# EAGLE design OSWDKPCB (EAGLE 6.3)
HARDWARE_VARIANT: OSWarrior Dark Knight (DK); PROJECT_NAME: OSWarrior

## Sheet 1 of 3
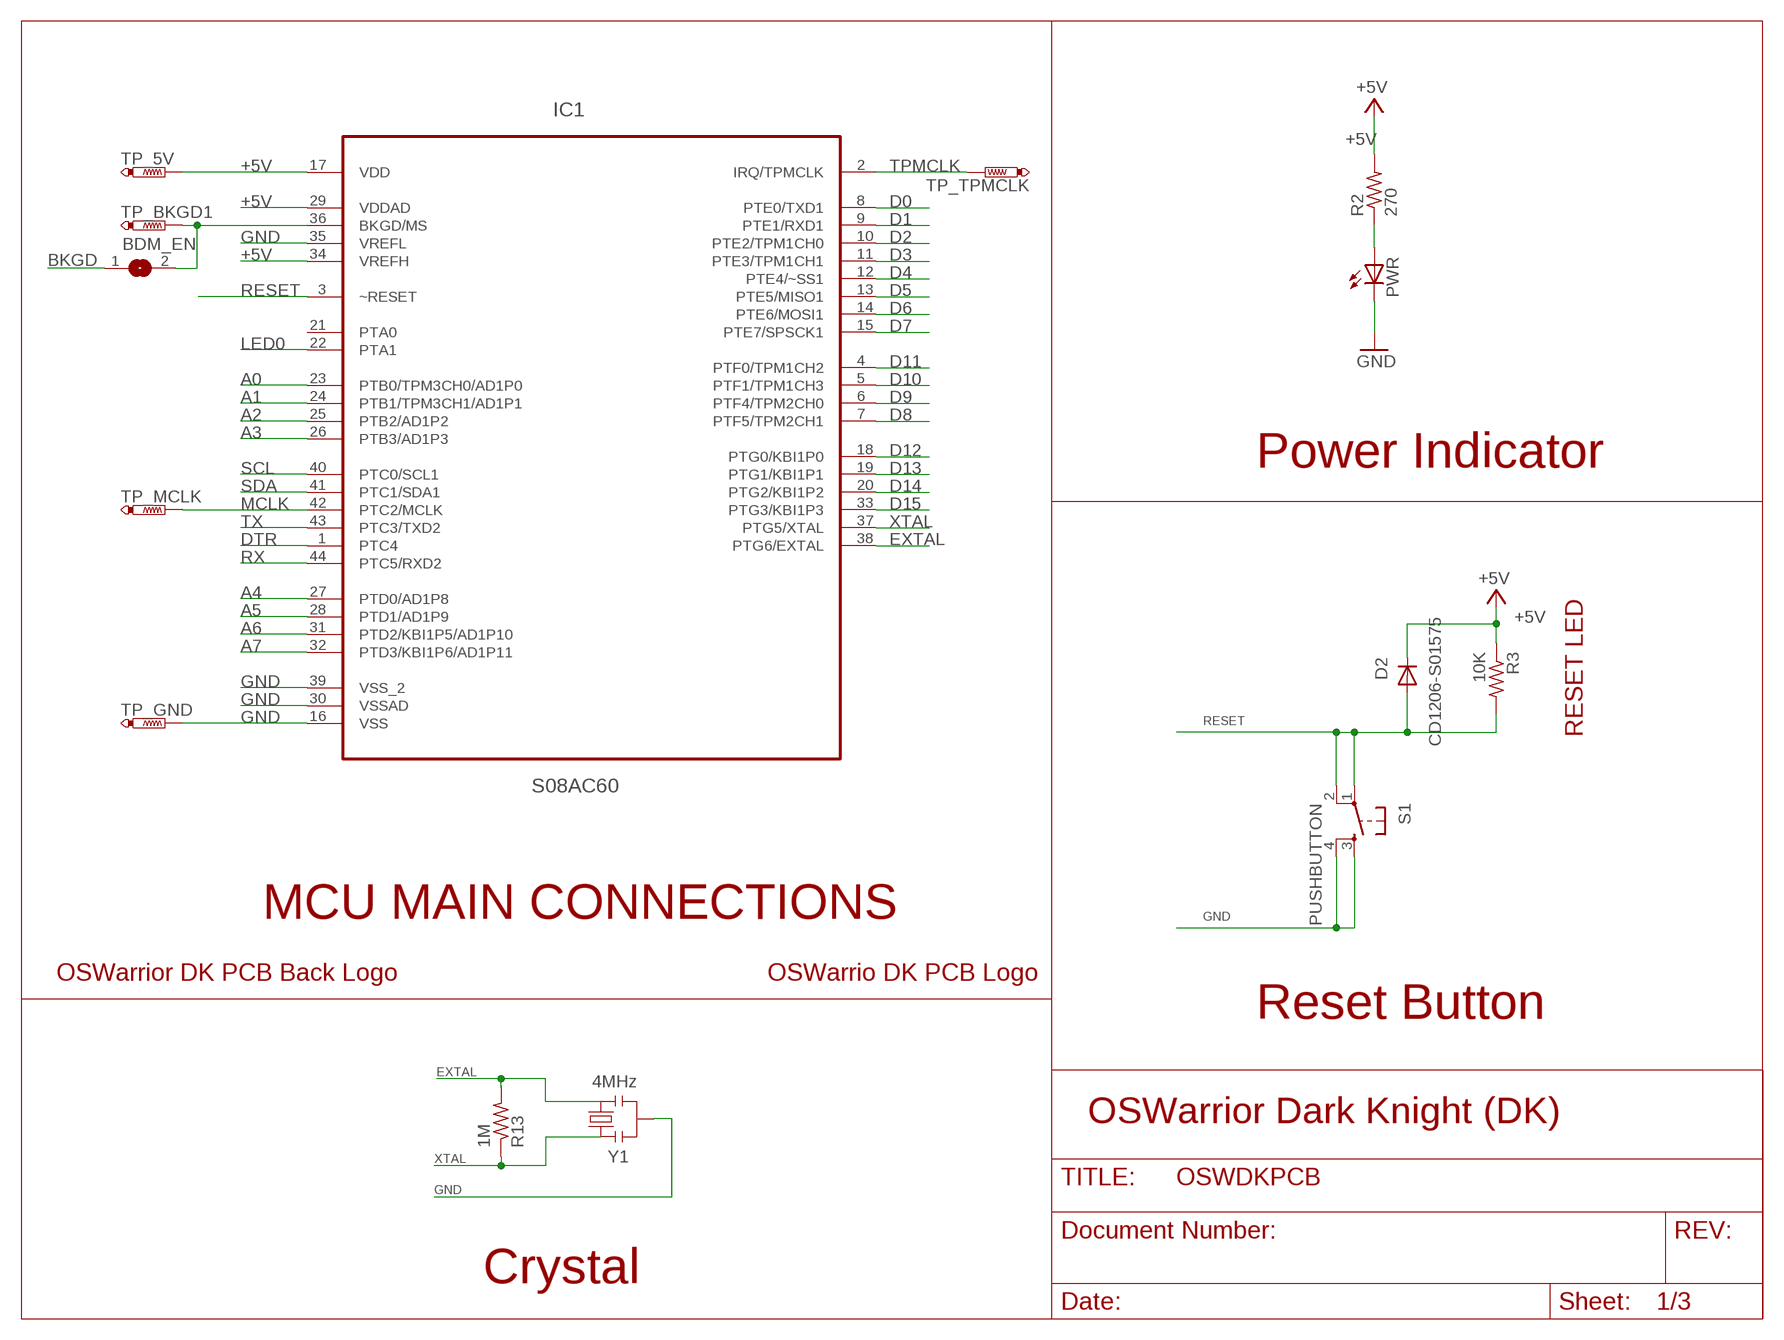
[diagram p0: schematic, sheet 1]

### Parts
BDM_EN  SJ  [SJ]
D2  CD1206-S01575  DIODE-SOD123  [SOD123]
IC1  S08AC60  MC9S08AC48CFGE_LQFP-44  [LQFP-44]
PWR  LEDCHIPLED_0805  [CHIPLED_0805]
R2  270  R-US_M0805  [M0805]
R3  10K  R-US_M0805  [M0805]
R13  1M  R-US_M0805  [M0805]
S1  PUSHBUTTON  TAC_SWITCHPTH  [TACTILE-PTH]
TP_5V  PTR1B1,27  [B1,27]
TP_BKGD1  PTR1B1,27  [B1,27]
TP_GND  PTR1B1,27  [B1,27]
TP_MCLK  PTR1B1,27  [B1,27]
TP_TPMCLK  PTR1B1,27  [B1,27]
U$1  OSWDK_LOGO  [OSWDK_LOGO]
U$2  OSWDK_BACK_LOGO  [OSWDK_BACK_LOGO]
Y1  4MHz  RESONATORSMD  [RESONATOR-SMD]

### Nets
+5V [power]: D2.C IC1.17(VDD) IC1.29(VDDAD) IC1.34(VREFH) R2.2 R3.1 TP_5V.TP ; also sheet 2,3
A0: IC1.23(PTB0/TPM3CH0/AD1P0) ; also sheet 2
A1: IC1.24(PTB1/TPM3CH1/AD1P1) ; also sheet 2
A2: IC1.25(PTB2/AD1P2) ; also sheet 2
A3: IC1.26(PTB3/AD1P3) ; also sheet 2
A4: IC1.27(PTD0/AD1P8) ; also sheet 2
A5: IC1.28(PTD1/AD1P9) ; also sheet 2
A6: IC1.31(PTD2/KBI1P5/AD1P10) ; also sheet 2
A7: IC1.32(PTD3/KBI1P6/AD1P11) ; also sheet 2
BKGD: BDM_EN.1 ; also sheet 3
D0: IC1.8(PTE0/TXD1) ; also sheet 2
D1: IC1.9(PTE1/RXD1) ; also sheet 2
D2: IC1.10(PTE2/TPM1CH0) ; also sheet 2
D3: IC1.11(PTE3/TPM1CH1) ; also sheet 2
D4: IC1.12(PTE4/~SS1) ; also sheet 2
D5: IC1.13(PTE5/MISO1) ; also sheet 2
D6: IC1.14(PTE6/MOSI1) ; also sheet 2
D7: IC1.15(PTE7/SPSCK1) ; also sheet 2
D8: IC1.7(PTF5/TPM2CH1) ; also sheet 2
D9: IC1.6(PTF4/TPM2CH0) ; also sheet 2
D10: IC1.5(PTF1/TPM1CH3) ; also sheet 2
D11: IC1.4(PTF0/TPM1CH2) ; also sheet 2
D12: IC1.18(PTG0/KBI1P0) ; also sheet 2
D13: IC1.19(PTG1/KBI1P1) ; also sheet 2
D14: IC1.20(PTG2/KBI1P2) ; also sheet 2
D15: IC1.33(PTG3/KBI1P3) ; also sheet 2
DTR: IC1.1(PTC4)
EXTAL: IC1.38(PTG6/EXTAL) R13.2 Y1.3
GND [power]: IC1.16(VSS) IC1.30(VSSAD) IC1.35(VREFL) IC1.39(VSS_2) PWR.C S1.3 S1.4 TP_GND.TP Y1.2 ; also sheet 2,3
LED0: IC1.22(PTA1) ; also sheet 2
MCLK: IC1.42(PTC2/MCLK) TP_MCLK.TP
N$6: BDM_EN.2 IC1.36(BKGD/MS) TP_BKGD1.TP
N$14: PWR.A R2.1
RESET: D2.A IC1.3(~RESET) R3.2 S1.1 S1.2 ; also sheet 2,3
RX: IC1.44(PTC5/RXD2) ; also sheet 3
SCL: IC1.40(PTC0/SCL1) ; also sheet 2
SDA: IC1.41(PTC1/SDA1) ; also sheet 2
TPMCLK: IC1.2(IRQ/TPMCLK) TP_TPMCLK.TP
TX: IC1.43(PTC3/TXD2) ; also sheet 3
XTAL: IC1.37(PTG5/XTAL) R13.1 Y1.1
Unconnected: IC1.21(PTA0)

### Notes on the sheet
- Power Indicator
- RESET LED
- MCU MAIN CONNECTIONS
- Reset Button
- Crystal

## Sheet 2 of 3
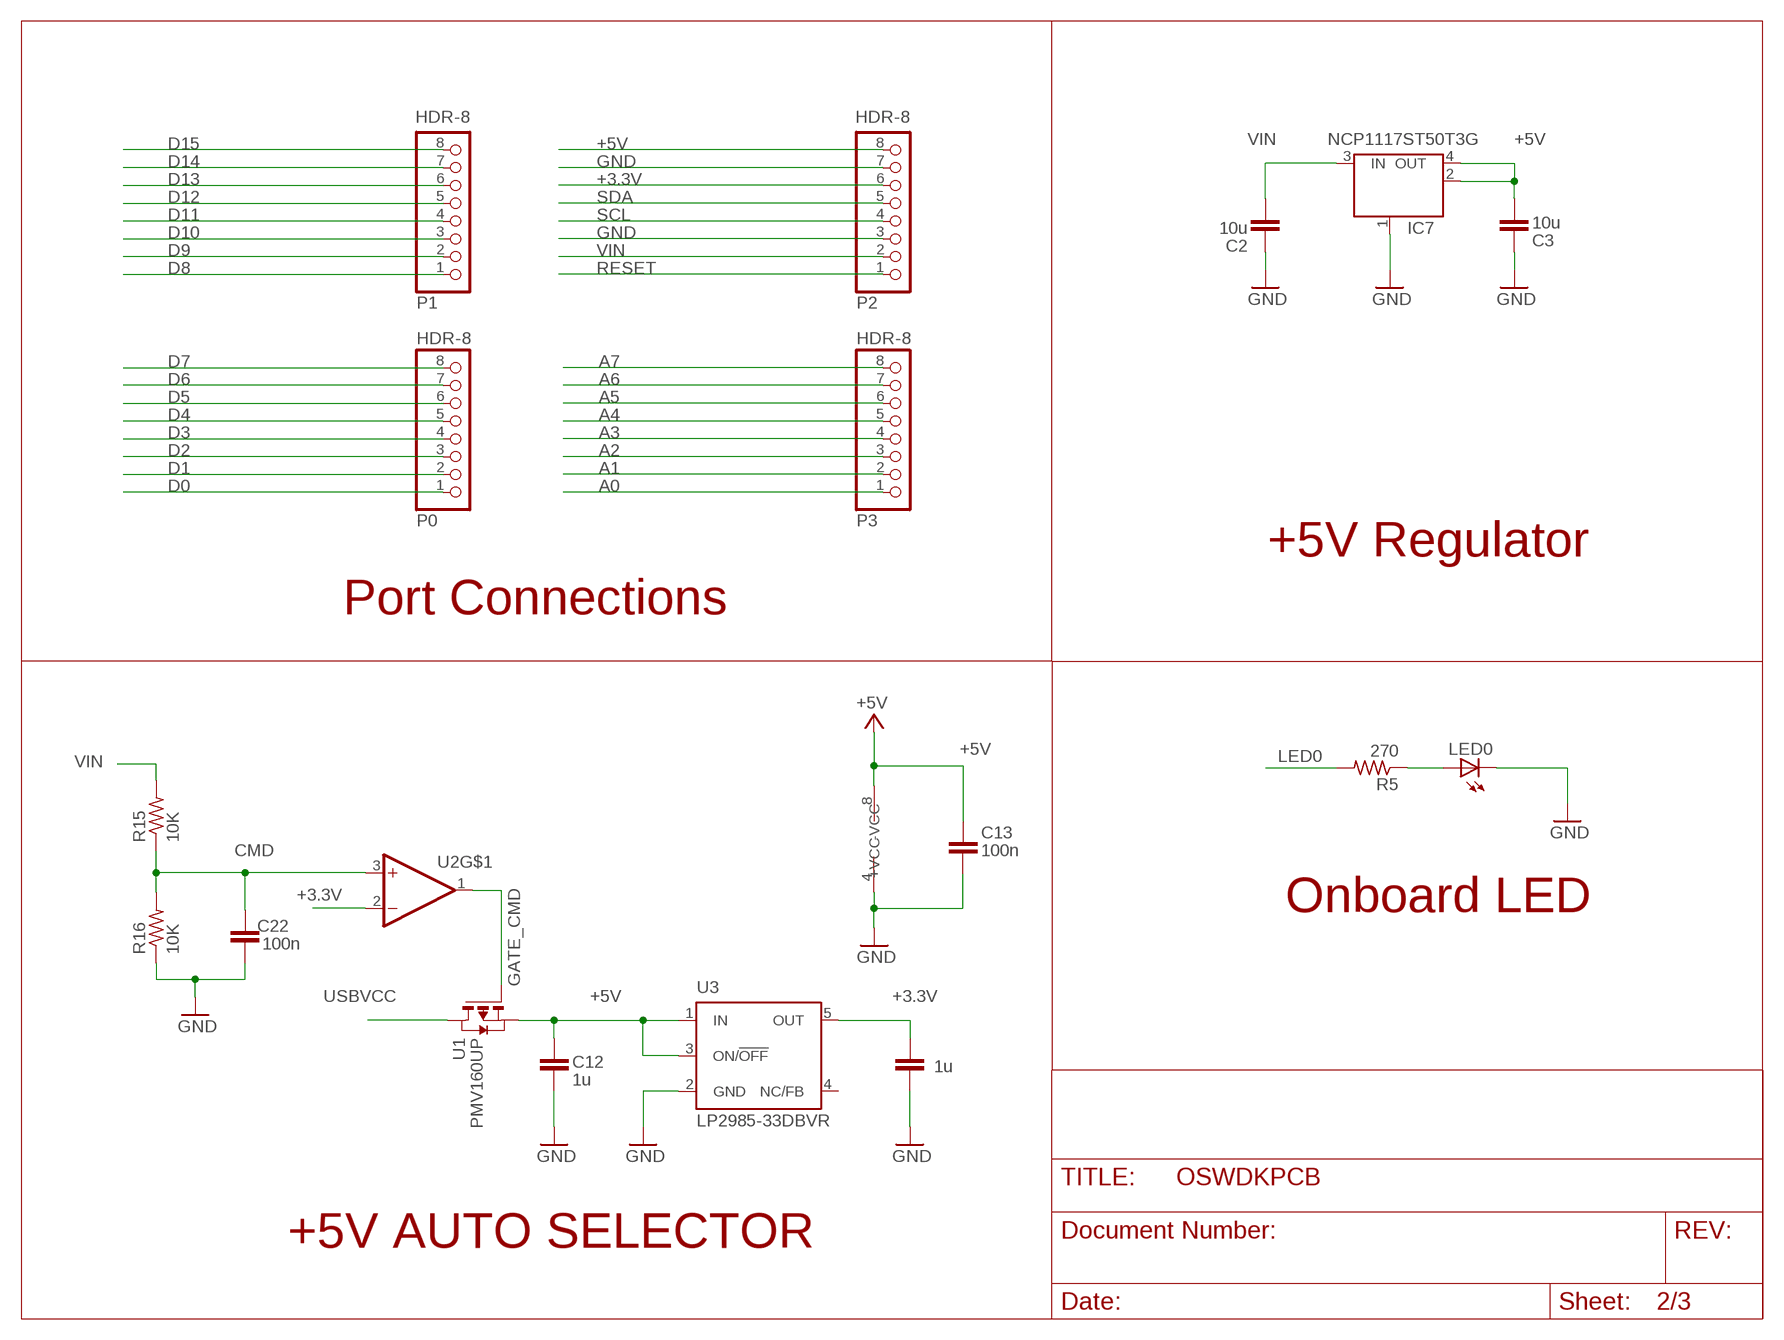
[diagram p1: schematic, sheet 2]

### Parts
C2  10u  C-EUC0805  [C0805]
C3  10u  C-EUC0805  [C0805]
C12  1u  C-EUC0805  [C0805]
C13  100n  C-EUC0805  [C0805]
C14  1u  C-EUC0805  [C0805]
C22  100n  C-EUC0805  [C0805]
IC7  NCP1117ST50T3G  MC33269ST-3.3T3  [SOT223]
LED0  LEDCHIPLED_0805  [CHIPLED_0805]
P0  HDR-8  PINHD-1X8  [1X08]
P1  HDR-8  PINHD-1X8  [1X08]
P2  HDR-8  PINHD-1X8  [1X08]
P3  HDR-8  PINHD-1X8  [1X08]
R5  270  R-US_M0805  [M0805]
R15  10K  R-US_M0805  [M0805]
R16  10K  R-US_M0805  [M0805]
U1  PMV160UP  [SOT-23]
U2  RC4558  [SOIC-8]
U3  LP2985-33DBVR  LP2985-XXDBVR33  [SOT23-DBV]

### Nets
+3.3V: C14.2 P2.6 U2.2(-IN1) U3.5(OUT)
+5V [power]: C3.1 C12.2 C13.1 IC7.2(OUT) IC7.4(OUT) P2.8 U1.2(S) U2.8(+VCC) U3.1(IN) U3.3(ON/!OFF) ; also sheet 1,3
A0: P3.1 ; also sheet 1
A1: P3.2 ; also sheet 1
A2: P3.3 ; also sheet 1
A3: P3.4 ; also sheet 1
A4: P3.5 ; also sheet 1
A5: P3.6 ; also sheet 1
A6: P3.7 ; also sheet 1
A7: P3.8 ; also sheet 1
CMD: C22.2 R15.1 R16.2 U2.3(+IN1)
D0: P0.1 ; also sheet 1
D1: P0.2 ; also sheet 1
D2: P0.3 ; also sheet 1
D3: P0.4 ; also sheet 1
D4: P0.5 ; also sheet 1
D5: P0.6 ; also sheet 1
D6: P0.7 ; also sheet 1
D7: P0.8 ; also sheet 1
D8: P1.1 ; also sheet 1
D9: P1.2 ; also sheet 1
D10: P1.3 ; also sheet 1
D11: P1.4 ; also sheet 1
D12: P1.5 ; also sheet 1
D13: P1.6 ; also sheet 1
D14: P1.7 ; also sheet 1
D15: P1.8 ; also sheet 1
GATE_CMD: U1.3(G) U2.1(OUT1)
GND [power]: C2.2 C3.2 C12.1 C13.2 C14.1 C22.1 IC7.1(GND/ADJ) LED0.C P2.3 P2.7 R16.1 U2.4(-VCC) U3.2(GND) ; also sheet 1,3
LED0: R5.2 ; also sheet 1
N$8: LED0.A R5.1
RESET: P2.1 ; also sheet 1,3
SCL: P2.4 ; also sheet 1
SDA: P2.5 ; also sheet 1
USBVCC [power]: U1.1(D) ; also sheet 3
VIN [power]: C2.1 IC7.3(IN) P2.2 R15.2
Unconnected: U2.5(+IN1) U2.6(-IN1) U2.7(OUT1) U3.4(NC/FB)

### Notes on the sheet
- +5V Regulator
- Port Connections
- Onboard LED
- +5V AUTO SELECTOR

## Sheet 3 of 3
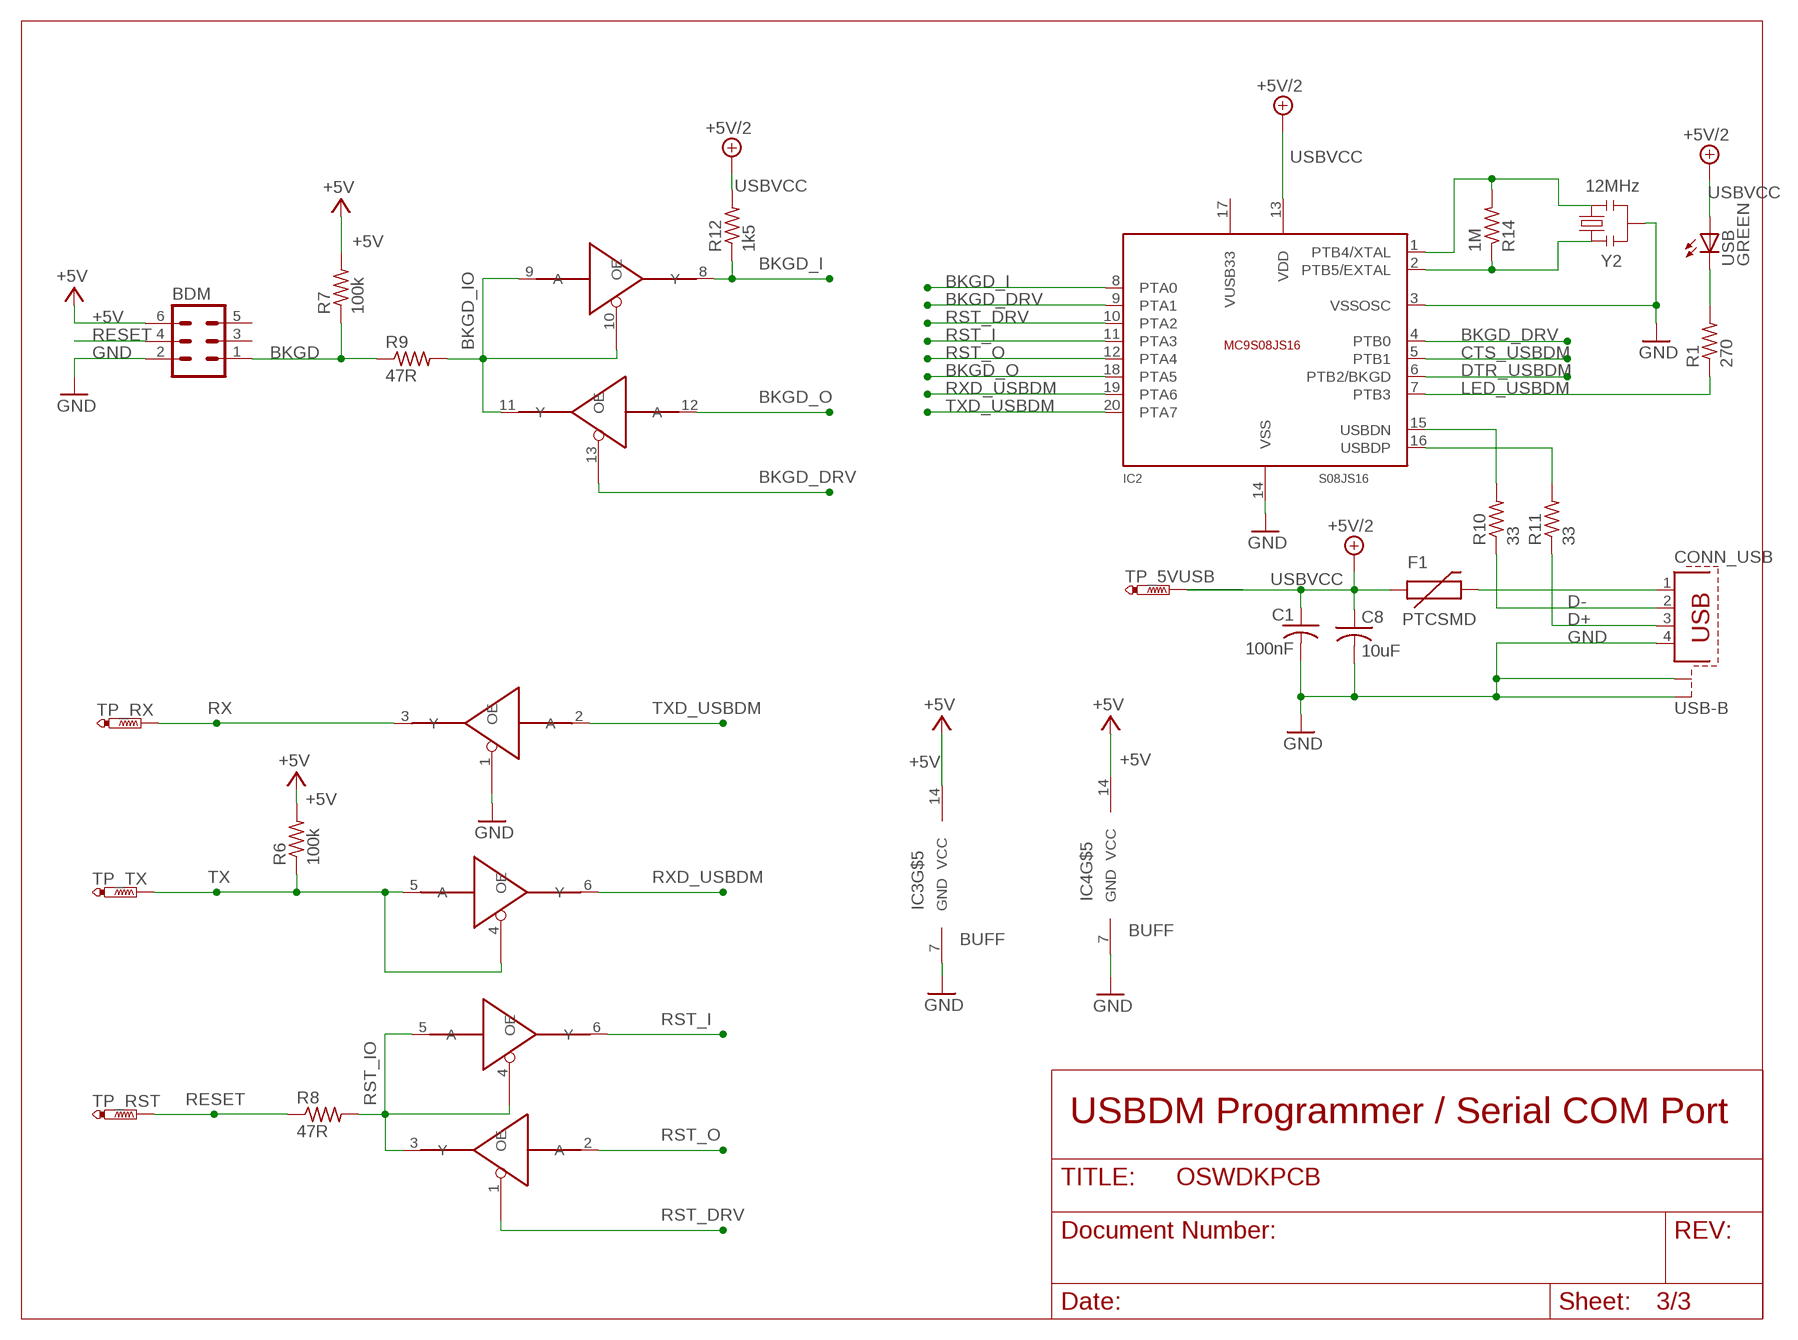
[diagram p2: schematic, sheet 3]

### Parts
BDM  MA03-2  [MA03-2]
C1  100nF  C-USC0805  [C0805]
C8  10uF  C-USC0805  [C0805]
CONN_USB  USB-B  PN61729-S  [PN61729-S]
F1  PTCSMD  [PTC-1206]
IC2  S08JS16  MC9S08JS16CWJ_SOIC-20  [SOIC-20]
IC3  BUFF  SN74LV125APW_TSSOP-14  [TSSOP-14]
IC4  BUFF  SN74LV125APW_TSSOP-14  [TSSOP-14]
R1  270  R-US_M0805  [M0805]
R6  100k  R-US_M0805  [M0805]
R7  100k  R-US_M0805  [M0805]
R8  47R  R-US_M0805  [M0805]
R9  47R  R-US_M0805  [M0805]
R10  33  R-US_M0805  [M0805]
R11  33  R-US_M0805  [M0805]
R12  1k5  R-US_M0805  [M0805]
R14  1M  R-US_M0805  [M0805]
TP_5VUSB  PTR1B1,27  [B1,27]
TP_RST  PTR1B1,27  [B1,27]
TP_RX  PTR1B1,27  [B1,27]
TP_TX  PTR1B1,27  [B1,27]
USB  GREEN  LEDCHIPLED_0805  [CHIPLED_0805]
Y2  12MHz  RESONATORSMD  [RESONATOR-SMD]

### Nets
+5V [power]: BDM.6 IC3.14(VCC) IC4.14(VCC) R6.2 R7.2 ; also sheet 1,2
BKGD: BDM.1 R7.1 R9.1 ; also sheet 1
BKGD_DRV: IC2.4(PTB0) IC2.9(PTA1) IC4.13(OE)
BKGD_I: IC2.8(PTA0) IC4.8(Y) R12.1
BKGD_IO: IC4.9(A) IC4.10(OE) IC4.11(Y) R9.2
BKGD_O: IC2.18(PTA5) IC4.12(A)
CTS_USBDM: IC2.5(PTB1)
D+: CONN_USB.3 R11.1
D-: CONN_USB.2 R10.1
DTR_USBDM: IC2.6(PTB2/BKGD)
GND [power]: BDM.2 C1.2 C8.2 CONN_USB.4 CONN_USB.S1 CONN_USB.S2 IC2.3(VSSOSC) IC2.14(VSS) IC3.1(OE) IC3.7(GND) IC4.7(GND) Y2.2 ; also sheet 1,2
LED_USBDM: IC2.7(PTB3) R1.1
N$1: R1.2 USB.C
N$2: IC2.15(USBDN) R10.2
N$3: IC2.16(USBDP) R11.2
N$4: IC2.1(PTB4/XTAL) R14.2 Y2.3
N$5: CONN_USB.1 F1.2
N$7: IC2.2(PTB5/EXTAL) R14.1 Y2.1
RESET: BDM.4 R8.1 TP_RST.TP ; also sheet 1,2
RST_DRV: IC2.10(PTA2) IC4.1(OE)
RST_I: IC2.11(PTA3) IC4.6(Y)
RST_IO: IC4.3(Y) IC4.4(OE) IC4.5(A) R8.2
RST_O: IC2.12(PTA4) IC4.2(A)
RX: IC3.3(Y) TP_RX.TP ; also sheet 1
RXD_USBDM: IC2.19(PTA6) IC3.6(Y)
TX: IC3.4(OE) IC3.5(A) R6.1 TP_TX.TP ; also sheet 1
TXD_USBDM: IC2.20(PTA7) IC3.2(A)
USBVCC [power]: C1.1 C8.1 F1.1 IC2.13(VDD) R12.2 TP_5VUSB.TP USB.A ; supply symbol labelled +5V/2 ; also sheet 2
Unconnected: BDM.3 BDM.5 IC3.8(Y) IC3.9(A) IC3.10(OE) IC3.11(Y) IC3.12(A) IC3.13(OE)

### Notes on the sheet
- USBDM Programmer / Serial COM Port

## Power pins joined to a net without a drawn wire
VUSB33: IC2.17(VUSB33)

## Library data of the parts
BDM = con-lstb:MA03-2: PIN HEADER; OC_FARNELL: unknown; OC_NEWARK: unknown
BDM_EN = jumper:SJ: SMD solder JUMPER
C1 C8 = resistor:C-US: CAPACITOR, American symbol
C2 C3 C12-C14 C22 = SmartPrj:C-EU: CAPACITOR, European symbol
CONN_USB = con-berg:PN61729-S: BERG USB connector; OC_FARNELL: unknown; OC_NEWARK: unknown
D2 = diode:DIODE-: DIODE
F1 = SparkFun:PTC: Resettable Fuse PTC Resettable Fuse. Spark Fun Electronics SKU : COM-08357
IC1 = OSWarrior:MC9S08AC48CFGE_LQFP-44
IC2 = OSWarrior:MC9S08JS16CWJ_SOIC-20
IC3 IC4 = OSWarrior:SN74LV125APW_TSSOP-14
IC7 = linear:MC33269ST*: Adjustable Output Low Dropout Voltage Regulator 800 mA Source: http://www.onsemi.com/pub/Collateral/MC33269-D.PDF
LED0 PWR USB = led:LED: LED OSRAM: - CHIPLED LG R971, LG N971, LY N971, LG Q971, LY Q971, LO R971, LY R971 LH N974, LH R974 LS Q976, LO Q976, LY Q976 LO Q996 - Hyper CHIPLED LW Q18S LB Q993, LB Q99A, LB R99A - SideLED LS A670, LO A670, LY A670, LG A670, LP A670 LB A673, LV A673, LT A673, LW A673 LH A674 LY A675 LS A676, LA A676, LO A676, LY A676, LW A676 LS A679, LY A679, LG A679 - Hyper Micro SIDELED® LS Y876, LA Y876, LO Y876, LY Y876 LT Y87S - SmartLED LW L88C, LW L88S LB L89C, LB L89S, LG L890 LS L89K, LO L89K, LY L89K LS L896, LA L896, LO L896, LY L896 - TOPLED LS T670, LO T670, LY T670, LG T670, LP T670 LSG T670, LSP T670, LSY T670, LOP T670, LYG T670 LG T671, LOG T671, LSG T671 LB T673, LV T673, LT T673, LW T673 LH T674 LS T676, LA T676, LO T676, LY T676, LB T676, LH T676, LSB T676, LW T676 LB T67C, LV T67C, LT T67C, LS T67K, LO T67K, LY T67K, LW E67C LS E67B, LA E67B, LO E67B, LY E67B, LB E67C, LV E67C, LT E67C LW T67C LS T679, LY T679, LG T679 LS T770, LO T770, LY T770, LG T770, LP T770 LB T773, LV T773, LT T773, LW T773 LH T774 LS E675, LA E675, LY E675, LS T675 LS T776, LA T776, LO T776, LY T776, LB T776 LHGB T686 LT T68C, LB T68C - Hyper Mini TOPLED® LB M676 - Mini TOPLED Santana® LG M470 LS M47K, LO M47K, LY M47K Source: http://www.osram.convergy.de LUXEON: - LUMILED® LXK2-PW12-R00, LXK2-PW12-S00, LXK2-PW14-U00, LXK2-PW14-V00 LXK2-PM12-R00, LXK2-PM12-S00, LXK2-PM14-U00 LXK2-PE12-Q00, LXK2-PE12-R00, LXK2-PE12-S00, LXK2-PE14-T00, LXK2-PE14-U00 LXK2-PB12-K00, LXK2-PB12-L00, LXK2-PB12-M00, LXK2-PB14-N00, LXK2-PB14-P00, LXK2-PB14-Q00 LXK2-PR12-L00, LXK2-PR12-M00, LXK2-PR14-Q00, LXK2-PR14-R00 LXK2-PD12-Q00, LXK2-PD12-R00, LXK2-PD12-S00 LXK2-PH12-R00, LXK2-PH12-S00 LXK2-PL12-P00, LXK2-PL12-Q00, LXK2-PL12-R00 Source: www.luxeon.com KINGBRIGHT: KA-3528ASYC Source: www.kingbright.com
P0 P1-P3 = pinhead:PINHD-1X8: PIN HEADER
R1-R3 R5-R16 = resistor:R-US_: RESISTOR, American symbol
S1 = SparkFun:TAC_SWITCH: Momentary Switch Button commonly used for reset or general input. Spark Fun Electronics SKU : COM-00097
TP_5V TP_5VUSB TP_BKGD1 TP_GND TP_MCLK TP_RST TP_RX TP_TPMCLK TP_TX = testpad:PTR1: TEST PIN
U1 = PMV160UP:PMV160UP: P-Channel MOSFET
U2 = PMV160UP:RC4558: Dual General-Purpose Operational Amplifier
U3 = SmartPrj:LP2985-XXDBVR: ULTRALOW-POWER 50-mA LOW-DROPOUT LINEAR REGULATORS 50-mA Low-Dropout Regulator Source: http://focus.ti.com/lit/ds/symlink/tps77001.pdf
U$1 = OSWarrior:OSWDK_LOGO
U$2 = OSWarrior:OSWDK_BACK_LOGO
Y1 Y2 = SparkFun:RESONATOR: Resonator Small SMD resonator. This is the itty bitty 10/20MHz resonators with built in caps. CSTCE10M0G55 and CSTCE20M0V53. Footprint has been reviewed closely but hasn't been tested yet.

## Net classes
0 default: width 0.406 mm
1 power: width 0.61 mm, drill 0.61 mm, clearance 0.254 mm
2 gnd: width 0.305 mm, drill 0.559 mm, clearance 0.254 mm
3 usbvcc: width 0.508 mm, drill 0.61 mm, clearance 0.254 mm
4 aref: width 0.406 mm, drill 0.61 mm, clearance 0.254 mm

## Board
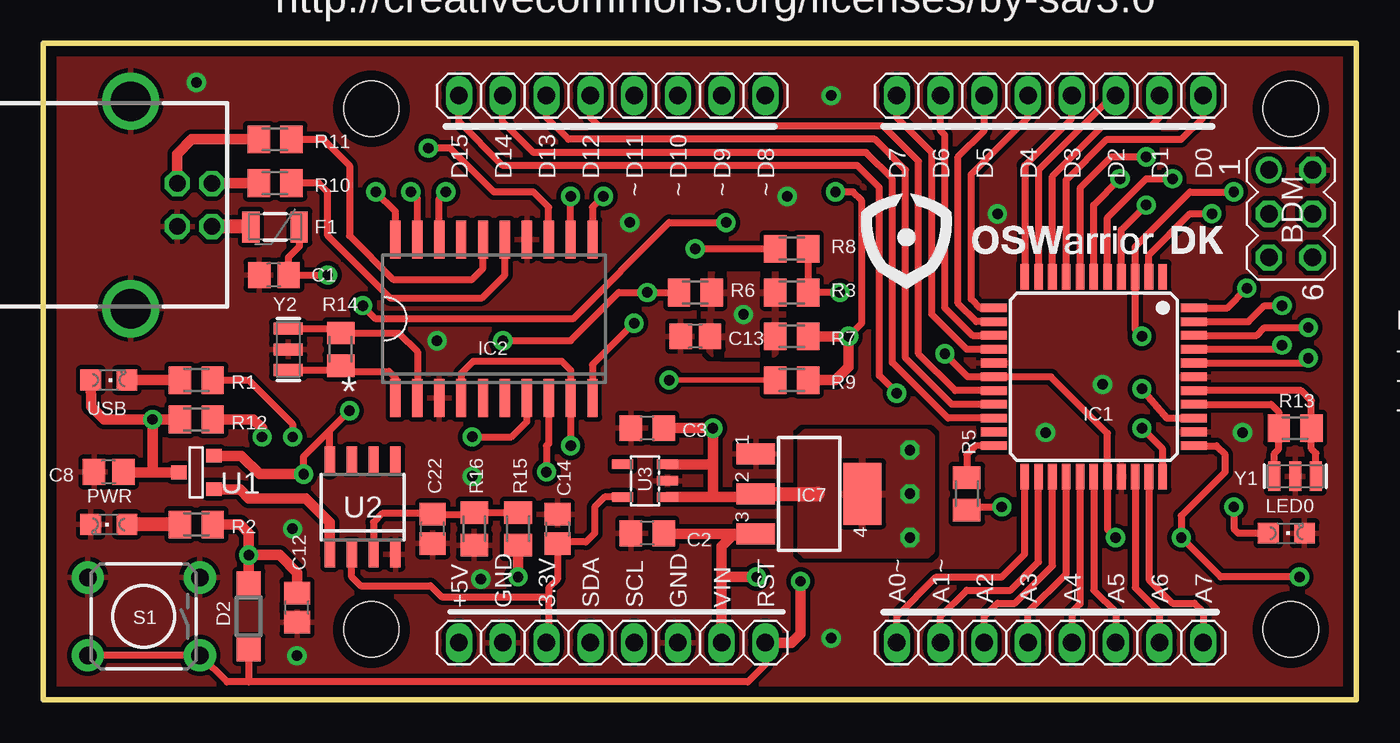
[diagram p3: board, top side]
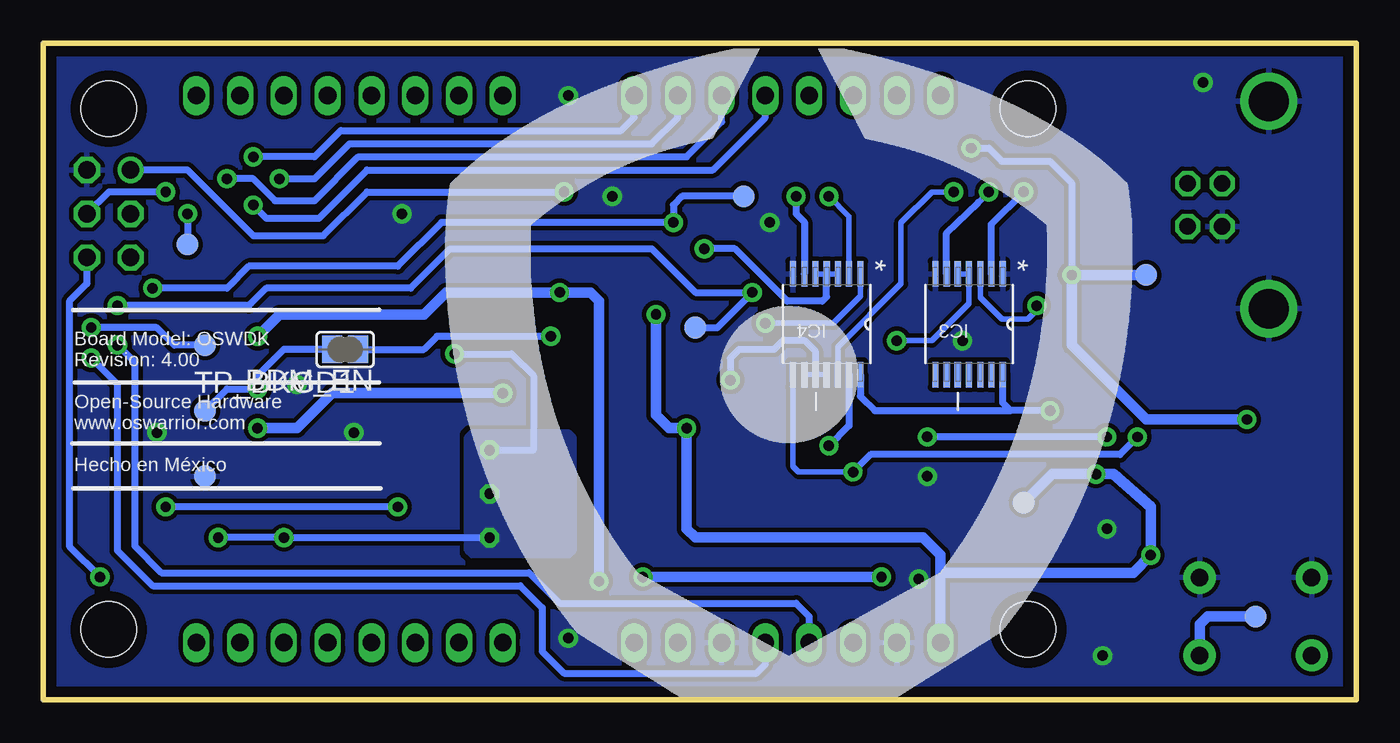
[diagram p4: board, bottom side, seen from below]

Size 76.2 x 38.1 mm. Coordinates in mm from the lower left corner, seen from the top.
Outline: 0,0 76.2,0 76.2,38.1 0,38.1 0,0
Copper layers (1*16): Top 0.035mm / dielectric 1.5mm / Bottom 0.035mm
Design rules "default *": minimum track width 10mil, minimum drill 22mil, track to track 10mil, track to pad 10mil, pad to pad 8mil, via to via 12mil, smd to smd 8mil, copper to edge 24mil, drill to drill 12mil, minimum pad ring 10mil, minimum via ring 10mil, stop-mask expansion 2mil, vias tented up to drill 30mil, thermal gap 10mil
Holes 3.2 mm at 19.05,34.29 72.39,4.06 19.05,4.06 72.39,34.29

### Footprints (pad centres in the part's own frame; a part is rotated, then mirrored left to right if it is on the bottom)
MA03-2 = drill 1.016: 1 -2.54,-1.27 | drill 1.016 octagon: 2 -2.54,1.27; 3 0,-1.27; 4 0,1.27; 5 2.54,-1.27; 6 2.54,1.27
SJ = smd 1.168 x 1.6: 1 -0.762,0; 2 0.762,0
C0805 = smd 1.3 x 1.5: 1 -0.85,0; 2 0.85,0
C0805' = smd 1.3 x 1.5: 1 -0.95,0; 2 0.95,0
PN61729-S = drill 0.95 octagon: 1 1.25,4.71; 2 -1.25,4.71; 3 -1.25,2.71; 4 1.25,2.71 | drill 2.3 pad 2.9: S1 -6.02,0; S2 6.02,0
SOD123 = smd 1.4 x 1.4: A 1.9,0; C -1.9,0
PTC-1206 = smd 1 x 1.8: 1 -1.4,0; 2 1.4,0
LQFP-44 = smd 1.5 x 0.5: 1 -5.8,4; 2 -5.8,3.2; 3 -5.8,2.4; 4 -5.8,1.6; 5 -5.8,0.8; 6 -5.8,0; 7 -5.8,-0.8; 8 -5.8,-1.6; 9 -5.8,-2.4; 10 -5.8,-3.2; 11 -5.8,-4; 23 5.8,-4; 24 5.8,-3.2; 25 5.8,-2.4; 26 5.8,-1.6; 27 5.8,-0.8; 28 5.8,0; 29 5.8,0.8; 30 5.8,1.6; 31 5.8,2.4; 32 5.8,3.2; 33 5.8,4 | smd 0.5 x 1.5: 12 -4,-5.8; 13 -3.2,-5.8; 14 -2.4,-5.8; 15 -1.6,-5.8; 16 -0.8,-5.8; 17 0,-5.8; 18 0.8,-5.8; 19 1.6,-5.8; 20 2.4,-5.8; 21 3.2,-5.8; 22 4,-5.8; 34 4,5.8; 35 3.2,5.8; 36 2.4,5.8; 37 1.6,5.8; 38 0.8,5.8; 39 0,5.8; 40 -0.8,5.8; 41 -1.6,5.8; 42 -2.4,5.8; 43 -3.2,5.8; 44 -4,5.8
SOIC-20 = smd 0.6 x 2.2: 1 -5.715,-4.6; 2 -4.445,-4.6; 3 -3.175,-4.6; 4 -1.905,-4.6; 5 -0.635,-4.6; 6 0.635,-4.6; 7 1.905,-4.6; 8 3.175,-4.6; 9 4.445,-4.6; 10 5.715,-4.6; 11 5.715,4.6; 12 4.445,4.6; 13 3.175,4.6; 14 1.905,4.6; 15 0.635,4.6; 16 -0.635,4.6; 17 -1.905,4.6; 18 -3.175,4.6; 19 -4.445,4.6; 20 -5.715,4.6
TSSOP-14 = smd 1.473 x 0.356: 1 -2.921,1.956; 2 -2.921,1.295; 3 -2.921,0.66; 4 -2.921,0; 5 -2.921,-0.66; 6 -2.921,-1.295; 7 -2.921,-1.956; 8 2.921,-1.956; 9 2.921,-1.295; 10 2.921,-0.66; 11 2.921,0; 12 2.921,0.66; 13 2.921,1.295; 14 2.921,1.956
SOT223 = smd 1.219 x 2.235: 1 -2.311,-3.099; 2 0,-3.099; 3 2.311,-3.099 | smd 3.6 x 2.2: 4 0,3.099
CHIPLED_0805 = smd 1.2 x 1.2: A 0,-1.05; C 0,1.05
1X08 = drill 1.016 long: 1 -8.89,0; 2 -6.35,0; 3 -3.81,0; 4 -1.27,0; 5 1.27,0; 6 3.81,0; 7 6.35,0; 8 8.89,0
M0805 = smd 1.3 x 1.6: 1 -0.95,0; 2 0.95,0
TACTILE-PTH = drill 1.016 pad 1.88: 1 -3.251,2.261; 2 3.251,2.261; 3 -3.251,-2.261; 4 3.251,-2.261
B1,27 = smd 1.27 x 1.27: TP 0,0
SOT-23 = smd 0.787 x 0.889: 1 0.025,-1.016; 2 -0.94,1.016; 3 0.991,1.016
SOIC-8 = smd 0.6 x 1.5: 1 -1.905,-2.75; 2 -0.635,-2.75; 3 0.635,-2.75; 4 1.905,-2.75; 5 1.905,2.75; 6 0.635,2.75; 7 -0.635,2.75; 8 -1.905,2.75
SOT23-DBV = smd 0.55 x 1.2: 1 -0.95,-1.3; 2 0,-1.3; 3 0.95,-1.3; 4 0.95,1.3; 5 -0.95,1.3
RESONATOR-SMD = smd 0.7 x 1.7: 1 -1.2,0; 2 0,0; 3 1.2,0

### Placement (x,y rotation side)
BDM  72.39,28.19 270 top
BDM_EN  58.67,20.32 180 bottom
C1  13.4,24.64 180 top
C2  10u  [C0805']  35.05,9.65 180 top
C3  10u  [C0805']  35.05,15.75 180 top
C8  3.81,13.21 180 top
C12  14.73,5.33 90 top
C13  37.85,21.08 180 top
C14  29.84,9.91 270 top
C22  22.61,9.91 90 top
CONN_USB  5.08,28.7 270 top
D2  11.94,4.83 270 top
F1  13.46,27.43 180 top
IC1  60.96,18.73 270 top
IC2  26.16,22.1 0 top
IC3  22.48,21.78 270 bottom
IC4  30.73,21.78 270 bottom
IC7  44.45,11.94 270 top
LED0  72.14,9.65 270 top
P0  58.42,35.05 180 top
P1  33.02,35.05 180 top
P2  33.02,3.3 180 top
P3  58.42,3.3 0 top
PWR  3.81,10.16 90 top
R1  8.89,18.54 180 top
R2  8.89,10.16 0 top
R3  43.43,23.62 0 top
R5  53.59,11.94 90 top
R6  37.85,23.62 0 top
R7  43.43,21.08 180 top
R8  43.43,26.16 180 top
R9  43.43,18.54 180 top
R10  13.46,29.97 0 top
R11  13.46,32.51 0 top
R12  8.89,16.26 180 top
R13  72.64,15.75 0 top
R14  17.27,20.32 270 top
R15  27.56,9.91 270 top
R16  25.02,9.91 90 top
S1  5.84,4.83 180 top
TP_5V  19.3,11.43 0 bottom
TP_5VUSB  12.19,24.64 0 bottom
TP_BKGD1  66.8,16.76 0 bottom
TP_GND  66.8,12.95 0 bottom
TP_MCLK  66.8,20.57 90 bottom
TP_RST  5.84,4.83 0 bottom
TP_RX  35.56,29.21 0 bottom
TP_TPMCLK  67.82,26.42 90 bottom
TP_TX  38.35,21.59 0 bottom
U1  8.89,13.21 270 top
U2  18.54,11.18 0 top
U3  34.92,12.7 90 top
U$1  58.53,25.91 0 top
U$2  33.02,19.3 0 top
USB  3.81,18.54 270 top
Y1  72.64,12.95 0 top
Y2  14.22,20.32 270 top

### Tracks (layer width: path | path; a pad name or v marks a point on that pad's centre or on a via)
+3.3V
  Top 0.406: U2.2 17.91,7.11 18.41,6.6 22.48,6.6 23.11,5.97 29.34,5.97 | 29.34,5.97 29.34,6.48 29.84,6.99 C14.2 29.93,9.14 31.5,9.14 32,9.65 32,11.18 32.58,11.75 U3.5 | 29.34,5.97 29.34,3.43 P2.6
+5V  (via drill 0.6 pad 1.02)
  Top 0.406: IC1.34 | IC1.34 68.07,14.73 68.58,14.22 68.58,13.21 66.04,10.67 v66.04,9.4 68.33,7.11 v72.9,7.11 | IC7.2 41.16,12.13 | v52.32,20.07 53.66,18.73 IC1.17 58.48,18.73 61.76,15.46 IC1.29 61.76,9.87 v62.23,9.4 | 16.64,15.62 15.11,14.1 v15.11,13.08 | U2.8 16.64,15.62 | 16.64,15.62 v17.78,16.76
  Top 0.61: R2.2 11.43,10.16 11.94,9.65 v11.94,8.38 | D2.C v11.94,8.38 | C12.2 14.73,7.37 13.72,8.38 v11.94,8.38 | U2.8 16.64,13.34 | U3.1 38.86,11.75 | 38.86,11.75 41.16,11.75 IC7.2 | C3.1 v38.86,15.75 38.86,13.72 | 38.86,13.72 38.86,11.75 | U3.3 38.8,13.65 38.86,13.72 | U1.2 11.51,14.15 12.57,13.08 v15.11,13.08
  Top 0.813: IC7.2 44.96,11.94
  Bottom 0.406: v66.04,9.4 v62.23,9.4 v50.29,9.4 | v50.29,14.48 47.75,14.48 47.75,18.8 49.02,20.07 v52.32,20.07 | v17.78,16.76 20.07,16.76 | 20.07,16.76 20.52,17.22 IC3.14 | v72.9,7.11 74.68,8.89 74.68,23.11 73.66,24.13 BDM.6 | IC4.14 28.78,17.6 27.94,16.76 20.07,16.76
  Bottom 0.61: P2.8 24.13,7.37 | 24.13,7.37 24.13,8.38 25.15,9.4 38.35,9.4 38.86,9.91 v38.86,15.75 39.88,15.75 40.64,16.51 v40.64,22.35 | 24.13,7.37 12.95,7.37 v11.94,8.38 11.94,11.18 14.1,13.08 v15.11,13.08 17.65,13.08 TP_5V.TP
  other vias: 50.29,11.94
  pour Top: 51.31,15.49 44.2,15.49 43.94,15.24 43.94,8.64 44.2,8.38 51.31,8.38 51.56,8.64 51.56,15.24
  pour Bottom: 51.31,15.49 45.72,15.49 45.47,15.24 45.47,8.64 45.72,8.38 51.31,8.38 51.56,8.64 51.56,15.24
  pour Top: 38.35,24.38 38.35,20.57 38.86,20.07 42.42,20.07 42.93,20.57 42.93,24.38 42.67,24.64 38.61,24.64
A0
  Top 0.406: P3.1 49.53,4.83 51.82,7.11 55.63,7.11 56.96,8.45 IC1.23
A1
  Top 0.406: P3.2 52.07,4.83 53.59,6.35 56.13,6.35 57.76,7.98 IC1.24
A2
  Top 0.406: P3.3 54.61,4.83 55.37,5.59 56.39,5.59 58.56,7.76 IC1.25
A3
  Top 0.406: P3.4 57.15,5.08 59.36,7.29 IC1.26
A4
  Top 0.406: IC1.27 60.16,5.55 59.69,5.08 P3.5
A5
  Top 0.406: IC1.28 60.96,6.35 62.23,5.08 P3.6
A6
  Top 0.406: IC1.31 63.36,6.49 64.77,5.08 P3.7
A7
  Top 0.406: IC1.32 64.16,6.96 65.53,5.59 66.8,5.59 67.31,5.08 P3.8
BKGD  (via drill 0.6 pad 1.02, 0.61 pad 1.02)
  Top 0.406: v46.74,21.08 47.5,21.84 47.5,28.96 46.99,29.46 v45.97,29.46
  Top 0.61: R7.1 v46.74,21.08 46.74,19.3 45.97,18.54 R9.1
  Bottom 0.406: v46.74,21.08 53.34,21.08 54.1,20.32 BDM_EN.1 | v45.97,29.46 57.4,29.46 59.94,26.92 64.01,26.92 67.82,30.73 BDM.1
BKGD_DRV  (via drill 0.61 pad 1.12)
  Top 0.406: v30.61,14.73 IC2.9 30.61,19.11 30.1,19.62 24.96,19.62 24.26,18.92 IC2.4
  Bottom 0.406: IC4.13 29.44,15.9 v30.61,14.73
BKGD_I  (via drill 0.6 pad 1.02, 0.61 pad 1.12)
  Top 0.406: IC2.8 29.34,14.86 29.21,14.73 v29.21,13.21
  Top 0.61: R12.1 12.19,16.26 12.7,15.75 v12.7,15.24
  Bottom 0.305: IC4.8 32.69,13.54 32.36,13.21 v29.21,13.21
  Bottom 0.406: v12.7,15.24 13.72,14.22 28.19,14.22 v29.21,13.21
BKGD_IO  (via drill 0.61 pad 1.02)
  Top 0.305: R9.2 v36.32,18.54
  Bottom 0.305: IC4.9 IC4.10 IC4.11
  Bottom 0.406: IC4.10 31.39,20.22 32,20.83 33.27,20.83 33.78,20.32 35.81,20.32 36.32,19.81 v36.32,18.54
BKGD_O  (via drill 0.61 pad 1.02)
  Top 0.406: IC2.18 22.99,29.08 v23.37,29.46
  Bottom 0.305: IC4.12 30.07,20.47 26.42,24.13 26.42,27.69 24.64,29.46 v23.37,29.46
CMD
  Top 0.406: R15.1 R16.2 24.79,10.76 C22.2 22.06,10.79 19.68,10.79 19.18,10.29 U2.3
D0
  Top 0.406: P0.1 67.31,33.78 66.04,32.51 61.72,32.51 59.36,30.15 IC1.8
D1
  Top 0.406: IC1.9 58.56,30.37 61.47,33.27 64.26,33.27 64.77,33.78 P0.2
D2
  Top 0.406: IC1.10 57.76,30.73 62.08,35.05 P0.3
D3
  Top 0.406: IC1.11 56.96,30.99 59.69,33.72 P0.4
D4
  Top 0.406: IC1.12 54.36,22.73 53.85,23.24 53.85,30.48 57.15,33.78 P0.5
D5
  Top 0.406: IC1.13 54.14,21.93 53.09,22.99 53.09,31.5 54.61,33.02 P0.6
D6
  Top 0.406: IC1.14 53.92,21.13 52.32,22.73 52.32,32.77 52.07,33.02 P0.7
D7
  Top 0.406: IC1.15 53.58,20.33 51.56,22.35 51.56,31.75 49.53,33.78 P0.8
D8  (via drill 0.61 pad 1.12)
  Top 0.406: IC1.7 60.16,29.68 61.98,31.5 v64.01,31.5
  Bottom 0.406: P1.1 41.91,33.78 42.67,33.02 58.93,33.02 60.45,31.5 v64.01,31.5
D9  (via drill 0.61 pad 1.12)
  Top 0.406: IC1.6 60.96,28.7 v62.48,30.23
  Bottom 0.406: v62.48,30.23 60.45,30.23 58.42,32.26 40.89,32.26 39.37,33.78 P1.2
D10  (via drill 0.61 pad 1.12)
  Top 0.406: IC1.5 61.76,27.98 64.01,30.23 v65.53,30.23
  Bottom 0.406: P1.3 36.83,33.53 38.86,31.5 57.91,31.5 60.45,28.96 62.74,28.96 64.01,30.23 v65.53,30.23
D11  (via drill 0.61 pad 1.12)
  Top 0.406: IC1.4 62.56,27.25 v64.01,28.7
  Bottom 0.406: v64.01,28.7 63.25,27.94 60.2,27.94 57.4,30.73 37.34,30.73 34.29,33.78 P1.4
D12
  Top 0.406: IC1.18 52.93,17.93 50.8,20.07 50.8,31.24 48.77,33.27 32.26,33.27 31.75,33.78 P1.5
D13
  Top 0.406: IC1.19 52.72,17.13 50.04,19.81 50.04,30.73 48.26,32.51 30.48,32.51 29.21,33.78 P1.6
D14
  Top 0.406: IC1.20 52.5,16.33 49.28,19.56 49.28,30.23 47.75,31.75 28.45,31.75 26.67,33.53 P1.7
D15  (via drill 0.61 pad 1.12)
  Top 0.406: IC1.33 64.96,14.54 v63.75,15.75 | v49.53,17.78 48.51,18.8 48.51,29.72 47.24,30.99 26.67,30.99 24.13,33.53 P1.8
  Bottom 0.61: v63.75,15.75 61.47,15.75 59.44,17.78 v49.53,17.78
D+
  Top 0.61: R11.1 8.64,32.51 7.79,31.67 CONN_USB.3
D-
  Top 0.61: CONN_USB.2 9.81,29.97 R10.1
EXTAL
  Top 0.406: IC1.38 73,17.93 73.59,17.34 R13.2 73.59,14.54 73.84,14.29 Y1.3
GATE_CMD
  Top 0.61: U2.1 16.64,10.29 15.24,11.68 11.94,11.68 11.43,12.19 9.93,12.19 U1.3
GND  (via drill 0.61 pad 1.12)
  other vias: 22.86,20.83 25.4,6.99 58.17,15.49 8.89,35.81 34.04,27.69 45.72,3.56 45.72,35.05 55.37,28.19 69.6,15.49 14.48,9.91 24.89,12.95 14.73,2.54 61.47,18.29 43.18,29.21
  pour Bottom (rank 2): 0,0 76.2,0 76.2,38.1 0,38.1
  pour Top (rank 2): 0,0 76.2,0 76.2,38.1 0,38.1
LED0
  Top 0.406: IC1.22 54.1,14.73 53.59,14.22 R5.2
LED_USBDM  (via drill 0.6 pad 1.02, 0.61 pad 1.02)
  Top 0.406: R1.1 11.94,18.54 14.48,16 v14.48,15.24 | v24.89,15.24 27.18,15.24 28.07,16.13 IC2.7
  Bottom 0.406: v14.48,15.24 v24.89,15.24
MCLK  (via drill 0.6 pad 1.02)
  Top 0.406: IC1.42 70.41,21.13 70.87,21.59 v73.41,21.59
  Bottom 0.406: TP_MCLK.TP 68.58,20.57 69.6,21.59 v73.41,21.59
N$1
  Top 0.61: USB.C R1.2
N$2
  Top 0.406: IC2.15 26.8,24.64 25.46,23.3 20.13,23.3 16.51,26.92 16.51,29.46 16,29.97 R10.2
N$3
  Top 0.406: IC2.16 25.53,25.02 24.89,24.38 20.32,24.38 17.78,26.92 17.78,30.99 16.26,32.51 R11.2
N$4
  Top 0.406: Y2.3 17.28,19.12 R14.2 17.71,19.05 20.07,19.05 20.45,18.67 IC2.1
N$5
  Top 0.813: F1.2 12.06,27.45 CONN_USB.1
N$6  (via drill 0.61 pad 1.12)
  Top 0.406: v63.75,18.03 65.2,16.33 IC1.36
  Bottom 0.406: BDM_EN.2 62.23,20.32 63.75,18.8 v63.75,18.03 65.53,18.03 TP_BKGD1.TP
N$7
  Top 0.406: Y2.1 17.02,21.52 R14.1 20.64,21.27 21.72,20.19 IC2.2
N$8  (via drill 0.6 pad 1.02)
  Top 0.406: R5.1 53.78,11.18 v55.63,11.18 | v69.09,11.18 69.09,9.91 69.34,9.65 LED0.A
  Bottom 0.406: v55.63,11.18 v69.09,11.18
N$14
  Top 0.813: R2.1 PWR.A
RESET  (via drill 0.6 pad 1.02, 0.61 pad 1.12)
  Top 0.406: v63.75,21.08 63.36,21.48 IC1.3 63.36,26.28 66.55,29.46 v69.09,29.46 | S1.2 S1.1 9.12,2.54 9.14,2.54 10.67,1.02 11.94,1.02 | R8.1 R3.2 v46.23,23.62 | P2.1 41.91,2.03 40.89,1.02 11.94,1.02 | D2.A 11.94,1.02
  Top 0.61: P2.1 43.43,3.3 43.94,3.81 v43.94,6.86
  Bottom 0.406: v69.09,29.46 72.39,29.46 BDM.4
  Bottom 0.61: v63.75,21.08 62.48,22.35 54.1,22.35 52.83,23.62 v46.23,23.62 44.45,23.62 43.94,23.11 v43.94,6.86 | TP_RST.TP 8.64,4.83 9.09,4.37 S1.1
RST_DRV  (via drill 0.61 pad 1.12)
  Top 0.406: IC2.10 31.88,19.43 v34.29,21.84
  Bottom 0.305: IC4.1 28.78,23.42 30.35,21.84 v34.29,21.84
RST_I  (via drill 0.61 pad 1.02)
  Top 0.406: IC2.11 31.88,28.57 v32.51,29.21
  Bottom 0.406: v32.51,29.21 32.51,28.19 32.03,27.71 IC4.6
RST_IO  (via drill 0.61 pad 1.02)
  Top 0.406: v37.85,26.16 R8.2
  Bottom 0.305: IC4.5 IC4.4 IC4.3
  Bottom 0.406: IC4.4 30.73,23.37 30.99,23.11 33.02,23.11 36.07,26.16 v37.85,26.16
RST_O  (via drill 0.61 pad 1.12)
  Top 0.406: IC2.12 v30.61,29.21
  Bottom 0.305: IC4.2 29.44,28.04 v30.61,29.21
RX  (via drill 0.6 pad 1.02, 0.61 pad 0.61, 0.61 pad 1.12)
  Top 0.406: v39.62,27.69 36.32,27.69 30.73,22.1 19.3,22.1 v18.54,22.86 | IC1.44 68.71,22.73 v69.85,23.88
  Bottom 0.305: IC3.3 21.82,23.34 20.57,22.1 19.05,22.1 18.54,22.61
  Bottom 0.406: 18.54,22.61 v18.54,22.86 | v69.85,23.88 65.53,23.88 64.26,25.15 55.63,25.15 53.09,27.69 v39.62,27.69 39.62,28.7 39.12,29.21 TP_RX.TP
RXD_USBDM  (via drill 0.61 pad 1.12)
  Top 0.406: IC2.19 21.72,29.08 v21.34,29.46
  Bottom 0.305: 21.95,28.85 v21.34,29.46
  Bottom 0.406: IC3.6 23.77,27.08 21.95,28.85
SCL  (via drill 0.6 pad 1.02)
  Top 0.406: IC1.40 73.13,19.53 v73.41,19.81
  Bottom 0.406: P2.4 34.29,2.03 34.8,1.52 45.97,1.52 47.24,2.79 47.24,5.33 48.51,6.6 69.85,6.6 71.88,8.64 71.88,18.29 v73.41,19.81
SDA  (via drill 0.61 pad 1.12)
  Top 0.406: IC1.41 71.64,20.33 v71.88,20.57
  Bottom 0.406: P2.5 31.75,4.83 32.51,5.59 46.23,5.59 48.01,7.37 69.34,7.37 70.87,8.89 70.87,19.56 v71.88,20.57
TPMCLK  (via drill 0.6 pad 1.02)
  Top 0.406: IC1.2 64.16,25.81 66.55,28.19 v67.82,28.19
  Bottom 0.406: v67.82,28.19 TP_TPMCLK.TP
TX  (via drill 0.61 pad 1.12)
  Top 0.406: v26.67,20.83 30.61,20.83 33.4,23.62 v35.05,23.62 R6.1 | IC1.43 69.94,21.93 70.87,22.86 v71.88,22.86
  Bottom 0.305: IC3.5 IC3.4 22.48,22.99 24.64,20.83 v26.67,20.83
  Bottom 0.406: TP_TX.TP 37.08,21.59 v35.05,23.62 38.35,23.62 40.89,26.16 52.58,26.16 54.86,23.88 63.25,23.88 64.26,22.86 v71.88,22.86
TXD_USBDM  (via drill 0.61 pad 1.12)
  Top 0.406: IC2.20 20.45,28.32 v19.3,29.46
  Bottom 0.406: IC3.2 21.18,27.58 v19.3,29.46
USBVCC  (via drill 0.6 pad 1.02)
  Top 0.406: 14.99,27.43 F1.1 14.86,26.29 14.22,25.65 14.22,24.66 C1.1 v16.51,24.64 | IC2.13 29.34,28.57 28.45,29.46 26.16,29.46 23.62,32 v22.35,32
  Top 0.61: USB.A 2.79,17.02 3.56,16.26 v6.35,16.26 | v6.35,16.26 R12.2 | 7.85,13.21 U1.1 6.35,13.18 | C8.1 4.68,13.18 6.35,13.18 | v6.35,16.26 6.35,13.18
  Bottom 0.406: v16.51,24.64 16.51,29.97 17.78,31.24 20.57,31.24 21.34,32 v22.35,32
  Bottom 0.61: TP_5VUSB.TP v16.51,24.64 16.51,20.57 12.19,16.26 v6.35,16.26
VIN  (via drill 0.6 pad 1.02)
  Top 0.61: R15.2 v27.56,7.11 | 41.15,7.11 v41.4,7.11 41.27,7.24 41.15,7.11 | 39.37,7.11 39.37,8.89 40.01,9.53 41.25,9.53 IC7.3 36.03,9.63 C2.1 | 39.37,7.11 P2.2 | 41.15,7.11 39.37,7.11
  Bottom 0.61: v41.4,7.11 v27.56,7.11
XTAL
  Top 0.406: IC1.37 71.26,17.13 71.69,16.7 R13.1 71.69,14.54 71.44,14.29 Y1.1

### Text on the board
tPlace: Released under the Creative Commons Attribution Share-Alike 3.0 License | http://creativecommons.org/licenses/by-sa/3.0 | Equipo OSWarrior: / - Hugo Arganda (hugo.arganda@oswarrior.com) / - Daniel Castellon (daniel.castellon@oswarrior.com) / - Isaac Avila (isaac.avila@oswarrior.com) | Los diseños son proporcionados "como son" y "con todos sus errores". / El equipo de OSWarrior no se hace responsable por el uso o manejo de / estos archivos asi como su reproducción total o parcial e incluso / la venta de los productos derivados de este diseño. / / El equipo de OSWarrior podría hacer cambios en las especificaciones y / descripciones del producto en cualquier momento sin previo aviso. / / OSWarrior es una marca registrada.
bPlace: Board Model: OSWDK / Revision: 4.00 / / Open-Source Hardware / www.oswarrior.com / / Hecho en México
tNames: D15 | D14 | D13 | D12 | D11 | D10 | D9 | D8 | D7 | D6 | D5 | D4 | D3 | D2 | D1 | D0 | ~ | ~ | ~ | ~ | ~ | ~ | A0 | A1 | A2 | A3 | A4 | A5 | A6 | A7 | +5V | GND | 3.3V | SDA | SCL | GND | VIN | RST